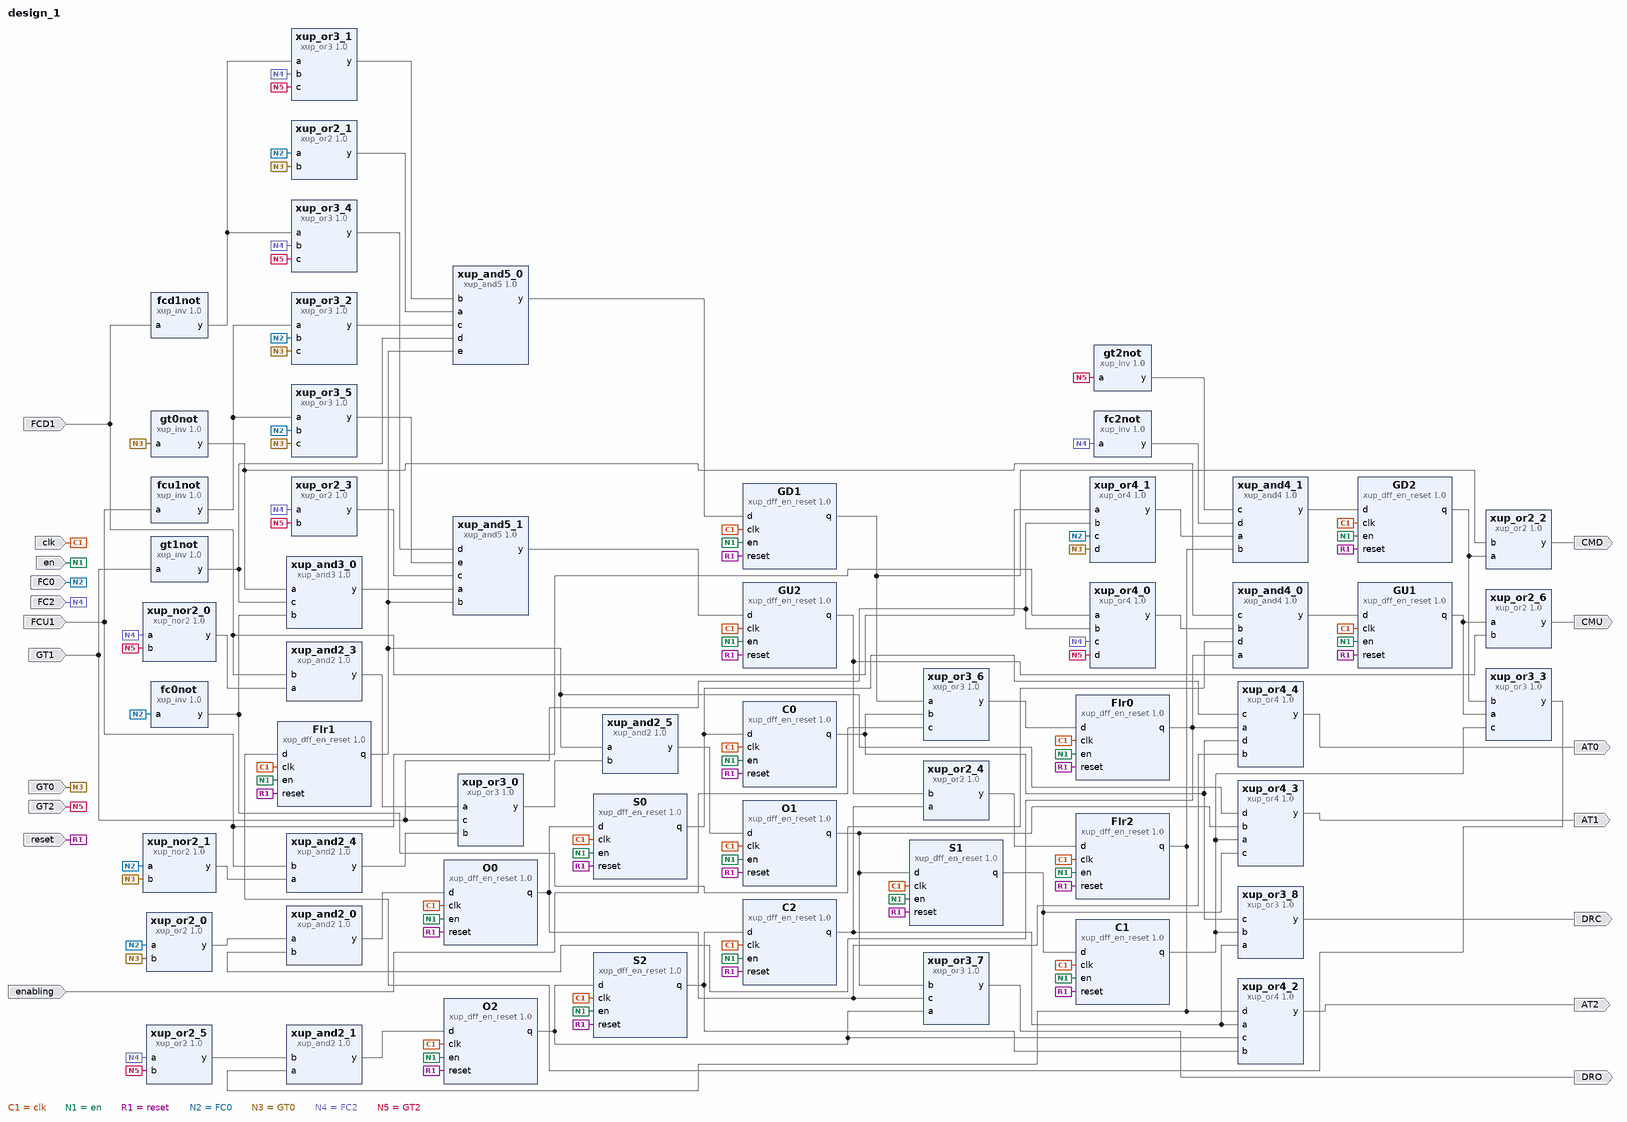
[diagram p0: block diagram of the top level]
# Vivado block design design_1, xc7k70tfbv676-1, Vivado 2020.1
create_bd_design design_1

create_bd_port -dir I FC0
create_bd_port -dir I FC2
create_bd_port -dir I FCU1
create_bd_port -dir I FCD1
create_bd_port -dir I GT0
create_bd_port -dir I GT1
create_bd_port -dir I GT2
create_bd_port -dir O DRC
create_bd_port -dir O DRO
create_bd_port -dir O AT0
create_bd_port -dir O AT1
create_bd_port -dir O AT2
create_bd_port -dir O CMU
create_bd_port -dir O CMD
create_bd_port -dir I en
create_bd_port -dir I reset
create_bd_port -dir I clk
create_bd_port -dir I enabling

create_bd_cell -type ip -vlnv xilinx.com:XUP:xup_dff_en_reset:1.0 Flr0
create_bd_cell -type ip -vlnv xilinx.com:XUP:xup_dff_en_reset:1.0 O0
create_bd_cell -type ip -vlnv xilinx.com:XUP:xup_dff_en_reset:1.0 S0
create_bd_cell -type ip -vlnv xilinx.com:XUP:xup_dff_en_reset:1.0 C0
create_bd_cell -type ip -vlnv xilinx.com:XUP:xup_or2:1.0 xup_or2_0
create_bd_cell -type ip -vlnv xilinx.com:XUP:xup_and2:1.0 xup_and2_0
create_bd_cell -type ip -vlnv xilinx.com:XUP:xup_dff_en_reset:1.0 GD1
create_bd_cell -type ip -vlnv xilinx.com:XUP:xup_dff_en_reset:1.0 GU1
create_bd_cell -type ip -vlnv xilinx.com:XUP:xup_and4:1.0 xup_and4_0
create_bd_cell -type ip -vlnv xilinx.com:XUP:xup_inv:1.0 fc2not
create_bd_cell -type ip -vlnv xilinx.com:XUP:xup_inv:1.0 gt2not
create_bd_cell -type ip -vlnv xilinx.com:XUP:xup_inv:1.0 gt1not
create_bd_cell -type ip -vlnv xilinx.com:XUP:xup_inv:1.0 fcu1not
create_bd_cell -type ip -vlnv xilinx.com:XUP:xup_inv:1.0 fcd1not
create_bd_cell -type ip -vlnv xilinx.com:XUP:xup_inv:1.0 fc0not
create_bd_cell -type ip -vlnv xilinx.com:XUP:xup_inv:1.0 gt0not
create_bd_cell -type ip -vlnv xilinx.com:XUP:xup_or4:1.0 xup_or4_0
create_bd_cell -type ip -vlnv xilinx.com:XUP:xup_dff_en_reset:1.0 Flr1
create_bd_cell -type ip -vlnv xilinx.com:XUP:xup_dff_en_reset:1.0 O1
create_bd_cell -type ip -vlnv xilinx.com:XUP:xup_dff_en_reset:1.0 S1
create_bd_cell -type ip -vlnv xilinx.com:XUP:xup_dff_en_reset:1.0 C1
create_bd_cell -type ip -vlnv xilinx.com:XUP:xup_or3:1.0 xup_or3_0
create_bd_cell -type ip -vlnv xilinx.com:XUP:xup_and2:1.0 xup_and2_3
create_bd_cell -type ip -vlnv xilinx.com:XUP:xup_and2:1.0 xup_and2_4
create_bd_cell -type ip -vlnv xilinx.com:XUP:xup_nor2:1.0 xup_nor2_0
create_bd_cell -type ip -vlnv xilinx.com:XUP:xup_nor2:1.0 xup_nor2_1
create_bd_cell -type ip -vlnv xilinx.com:XUP:xup_and5:1.0 xup_and5_0
create_bd_cell -type ip -vlnv xilinx.com:XUP:xup_or3:1.0 xup_or3_1
create_bd_cell -type ip -vlnv xilinx.com:XUP:xup_or3:1.0 xup_or3_2
create_bd_cell -type ip -vlnv xilinx.com:XUP:xup_or2:1.0 xup_or2_1
create_bd_cell -type ip -vlnv xilinx.com:XUP:xup_and2:1.0 xup_and2_5
create_bd_cell -type ip -vlnv xilinx.com:XUP:xup_dff_en_reset:1.0 GD2
create_bd_cell -type ip -vlnv xilinx.com:XUP:xup_or3:1.0 xup_or3_3
create_bd_cell -type ip -vlnv xilinx.com:XUP:xup_dff_en_reset:1.0 GU2
create_bd_cell -type ip -vlnv xilinx.com:XUP:xup_and3:1.0 xup_and3_0
create_bd_cell -type ip -vlnv xilinx.com:XUP:xup_and5:1.0 xup_and5_1
create_bd_cell -type ip -vlnv xilinx.com:XUP:xup_or3:1.0 xup_or3_4
create_bd_cell -type ip -vlnv xilinx.com:XUP:xup_or3:1.0 xup_or3_5
create_bd_cell -type ip -vlnv xilinx.com:XUP:xup_or2:1.0 xup_or2_3
create_bd_cell -type ip -vlnv xilinx.com:XUP:xup_dff_en_reset:1.0 Flr2
create_bd_cell -type ip -vlnv xilinx.com:XUP:xup_dff_en_reset:1.0 O2
create_bd_cell -type ip -vlnv xilinx.com:XUP:xup_dff_en_reset:1.0 S2
create_bd_cell -type ip -vlnv xilinx.com:XUP:xup_dff_en_reset:1.0 C2
create_bd_cell -type ip -vlnv xilinx.com:XUP:xup_or2:1.0 xup_or2_4
create_bd_cell -type ip -vlnv xilinx.com:XUP:xup_and2:1.0 xup_and2_1
create_bd_cell -type ip -vlnv xilinx.com:XUP:xup_or2:1.0 xup_or2_5
create_bd_cell -type ip -vlnv xilinx.com:XUP:xup_and4:1.0 xup_and4_1
create_bd_cell -type ip -vlnv xilinx.com:XUP:xup_or4:1.0 xup_or4_1
create_bd_cell -type ip -vlnv xilinx.com:XUP:xup_or3:1.0 xup_or3_6
create_bd_cell -type ip -vlnv xilinx.com:XUP:xup_or3:1.0 xup_or3_7
create_bd_cell -type ip -vlnv xilinx.com:XUP:xup_or3:1.0 xup_or3_8
create_bd_cell -type ip -vlnv xilinx.com:XUP:xup_or4:1.0 xup_or4_2
create_bd_cell -type ip -vlnv xilinx.com:XUP:xup_or4:1.0 xup_or4_3
create_bd_cell -type ip -vlnv xilinx.com:XUP:xup_or4:1.0 xup_or4_4
create_bd_cell -type ip -vlnv xilinx.com:XUP:xup_or2:1.0 xup_or2_2
create_bd_cell -type ip -vlnv xilinx.com:XUP:xup_or2:1.0 xup_or2_6

# ---- connections ----

connect_bd_net [get_bd_ports clk] \
  [get_bd_pins O0/clk] [get_bd_pins S0/clk] [get_bd_pins C0/clk] [get_bd_pins Flr0/clk] [get_bd_pins GD1/clk] \
  [get_bd_pins GU1/clk] [get_bd_pins Flr1/clk] [get_bd_pins O1/clk] [get_bd_pins S1/clk] [get_bd_pins C1/clk] \
  [get_bd_pins GU2/clk] [get_bd_pins GD2/clk] [get_bd_pins O2/clk] [get_bd_pins S2/clk] [get_bd_pins C2/clk] \
  [get_bd_pins Flr2/clk]
connect_bd_net [get_bd_ports en] \
  [get_bd_pins O0/en] [get_bd_pins Flr0/en] [get_bd_pins C0/en] [get_bd_pins S0/en] [get_bd_pins GD1/en] [get_bd_pins GU1/en] \
  [get_bd_pins Flr1/en] [get_bd_pins O1/en] [get_bd_pins C1/en] [get_bd_pins S1/en] [get_bd_pins GU2/en] [get_bd_pins GD2/en] \
  [get_bd_pins O2/en] [get_bd_pins S2/en] [get_bd_pins C2/en] [get_bd_pins Flr2/en]
connect_bd_net [get_bd_ports reset] \
  [get_bd_pins O0/reset] [get_bd_pins Flr0/reset] [get_bd_pins C0/reset] [get_bd_pins S0/reset] [get_bd_pins GD1/reset] \
  [get_bd_pins GU1/reset] [get_bd_pins Flr1/reset] [get_bd_pins O1/reset] [get_bd_pins S1/reset] [get_bd_pins C1/reset] \
  [get_bd_pins GU2/reset] [get_bd_pins GD2/reset] [get_bd_pins Flr2/reset] [get_bd_pins C2/reset] [get_bd_pins O2/reset] \
  [get_bd_pins S2/reset]
connect_bd_net -net DoorOpen0_q [get_bd_pins O0/q] [get_bd_pins S0/d] [get_bd_pins xup_or3_7/c] [get_bd_pins xup_or4_4/b]
connect_bd_net -net Wait0_q [get_bd_pins S0/q] [get_bd_pins C0/d] [get_bd_pins xup_or4_4/c]
connect_bd_net -net FC0_1 [get_bd_ports FC0] \
  [get_bd_pins xup_or2_0/a] [get_bd_pins fc0not/a] [get_bd_pins xup_nor2_1/a] [get_bd_pins xup_or2_1/a] \
  [get_bd_pins xup_or3_2/b] [get_bd_pins xup_or3_5/b] [get_bd_pins xup_or4_1/c]
connect_bd_net -net GT0_1 [get_bd_ports GT0] \
  [get_bd_pins xup_or2_0/b] [get_bd_pins gt0not/a] [get_bd_pins xup_nor2_1/b] [get_bd_pins xup_or2_1/b] \
  [get_bd_pins xup_or3_2/c] [get_bd_pins xup_or3_5/c] [get_bd_pins xup_or4_1/d]
connect_bd_net [get_bd_pins xup_or2_0/y] [get_bd_pins xup_and2_0/a]
connect_bd_net -net FLOOR0_q [get_bd_pins Flr0/q] [get_bd_pins xup_and2_0/b] [get_bd_pins xup_and4_0/a] [get_bd_pins xup_or4_4/a]
connect_bd_net [get_bd_pins xup_and2_0/y] [get_bd_pins O0/d]
connect_bd_net -net FC2_1 [get_bd_ports FC2] \
  [get_bd_pins fc2not/a] [get_bd_pins xup_or4_0/c] [get_bd_pins xup_nor2_0/a] [get_bd_pins xup_or3_1/b] \
  [get_bd_pins xup_or3_4/b] [get_bd_pins xup_or2_3/a] [get_bd_pins xup_or2_5/a]
connect_bd_net -net GT2_1 [get_bd_ports GT2] \
  [get_bd_pins gt2not/a] [get_bd_pins xup_or4_0/d] [get_bd_pins xup_nor2_0/b] [get_bd_pins xup_or3_1/c] \
  [get_bd_pins xup_or3_4/c] [get_bd_pins xup_or2_3/b] [get_bd_pins xup_or2_5/b]
connect_bd_net -net GT1_1 [get_bd_ports GT1] [get_bd_pins gt1not/a] [get_bd_pins xup_or4_0/b] [get_bd_pins xup_or3_0/c] [get_bd_pins xup_or4_1/b]
connect_bd_net -net FCU1_1 [get_bd_ports FCU1] [get_bd_pins fcu1not/a] [get_bd_pins xup_or4_0/a] [get_bd_pins xup_and2_4/b]
connect_bd_net -net FCD1_1 [get_bd_ports FCD1] [get_bd_pins fcd1not/a] [get_bd_pins xup_and2_3/b] [get_bd_pins xup_or4_1/a]
connect_bd_net [get_bd_pins xup_or4_0/y] [get_bd_pins xup_and4_0/b]
connect_bd_net -net notGT0_y [get_bd_pins gt0not/y] [get_bd_pins xup_and4_0/c] [get_bd_pins xup_and3_0/a]
connect_bd_net -net notFC0_y [get_bd_pins fc0not/y] [get_bd_pins xup_and4_0/d] [get_bd_pins xup_and3_0/b]
connect_bd_net [get_bd_pins xup_and4_0/y] [get_bd_pins GU1/d]
connect_bd_net -net DoorOpen1_q [get_bd_pins O1/q] [get_bd_pins S1/d] [get_bd_pins xup_or3_7/b] [get_bd_pins xup_or4_3/b]
connect_bd_net -net Wait1_q [get_bd_pins S1/q] [get_bd_pins C1/d] [get_bd_pins xup_or4_3/c]
connect_bd_net [get_bd_pins xup_and2_3/y] [get_bd_pins xup_or3_0/a]
connect_bd_net [get_bd_pins xup_and2_4/y] [get_bd_pins xup_or3_0/b]
connect_bd_net [get_bd_pins xup_nor2_0/y] [get_bd_pins xup_and2_3/a]
connect_bd_net [get_bd_pins xup_nor2_1/y] [get_bd_pins xup_and2_4/a]
connect_bd_net [get_bd_pins xup_and5_0/y] [get_bd_pins GD1/d]
connect_bd_net [get_bd_pins xup_or2_1/y] [get_bd_pins xup_and5_0/a]
connect_bd_net [get_bd_pins xup_or3_1/y] [get_bd_pins xup_and5_0/b]
connect_bd_net [get_bd_pins xup_or3_2/y] [get_bd_pins xup_and5_0/c]
connect_bd_net [get_bd_pins xup_or3_0/y] [get_bd_pins xup_and2_5/b]
connect_bd_net -net FLOOR1_q [get_bd_pins Flr1/q] \
  [get_bd_pins xup_and2_5/a] [get_bd_pins xup_and5_0/e] [get_bd_pins xup_and5_1/b] [get_bd_pins xup_or4_3/d]
connect_bd_net [get_bd_pins xup_and2_5/y] [get_bd_pins O1/d]
connect_bd_net -net notGT1_y [get_bd_pins gt1not/y] [get_bd_pins xup_and5_0/d] [get_bd_pins xup_and3_0/c]
connect_bd_net -net notFCD1_y [get_bd_pins fcd1not/y] [get_bd_pins xup_or3_1/a] [get_bd_pins xup_or3_4/a]
connect_bd_net -net notFCU1_y [get_bd_pins fcu1not/y] [get_bd_pins xup_or3_2/a] [get_bd_pins xup_or3_5/a]
connect_bd_net -net EU1_q [get_bd_pins GU1/q] [get_bd_pins xup_or3_3/a] [get_bd_pins xup_or2_6/a]
connect_bd_net -net ED2_q [get_bd_pins GD2/q] [get_bd_pins xup_or3_3/b] [get_bd_pins xup_or2_2/a]
connect_bd_net -net DoorClose1_q [get_bd_pins C1/q] [get_bd_pins xup_or3_3/c] [get_bd_pins xup_or3_8/b] [get_bd_pins xup_or4_3/a]
connect_bd_net [get_bd_pins xup_or3_3/y] [get_bd_pins Flr1/d]
connect_bd_net [get_bd_pins xup_and3_0/y] [get_bd_pins xup_and5_1/a]
connect_bd_net [get_bd_pins xup_and5_1/y] [get_bd_pins GU2/d]
connect_bd_net [get_bd_pins xup_or2_3/y] [get_bd_pins xup_and5_1/c]
connect_bd_net [get_bd_pins xup_or3_4/y] [get_bd_pins xup_and5_1/d]
connect_bd_net [get_bd_pins xup_or3_5/y] [get_bd_pins xup_and5_1/e]
connect_bd_net -net DoorOpen2_q [get_bd_pins O2/q] [get_bd_pins S2/d] [get_bd_pins xup_or3_7/a] [get_bd_pins xup_or4_2/c]
connect_bd_net -net Wait2_q [get_bd_pins S2/q] [get_bd_pins C2/d] [get_bd_pins xup_or4_2/b]
connect_bd_net [get_bd_pins xup_or2_4/y] [get_bd_pins Flr2/d]
connect_bd_net -net DoorClose2_q [get_bd_pins C2/q] [get_bd_pins xup_or2_4/a] [get_bd_pins xup_or3_8/a] [get_bd_pins xup_or4_2/a]
connect_bd_net -net EU2_q [get_bd_pins GU2/q] [get_bd_pins xup_or2_4/b] [get_bd_pins xup_or2_6/b]
connect_bd_net -net FLOOR2_q [get_bd_pins Flr2/q] [get_bd_pins xup_and2_1/a] [get_bd_pins xup_and4_1/b] [get_bd_pins xup_or4_2/d]
connect_bd_net [get_bd_pins xup_or2_5/y] [get_bd_pins xup_and2_1/b]
connect_bd_net [get_bd_pins xup_and2_1/y] [get_bd_pins O2/d]
connect_bd_net [get_bd_pins xup_and4_1/y] [get_bd_pins GD2/d]
connect_bd_net [get_bd_pins xup_or4_1/y] [get_bd_pins xup_and4_1/a]
connect_bd_net -net notGT2_y [get_bd_pins gt2not/y] [get_bd_pins xup_and4_1/c]
connect_bd_net -net notFC2_y [get_bd_pins fc2not/y] [get_bd_pins xup_and4_1/d]
connect_bd_net -net ED1_q [get_bd_pins GD1/q] [get_bd_pins xup_or3_6/a] [get_bd_pins xup_or2_2/b]
connect_bd_net -net DoorClose0_q [get_bd_pins C0/q] [get_bd_pins xup_or3_6/b] [get_bd_pins xup_or3_8/c] [get_bd_pins xup_or4_4/d]
connect_bd_net -net tempInput_1 [get_bd_ports enabling] [get_bd_pins xup_or3_6/c]
connect_bd_net [get_bd_pins xup_or3_6/y] [get_bd_pins Flr0/d]
connect_bd_net [get_bd_pins xup_or3_7/y] [get_bd_ports DRO]
connect_bd_net [get_bd_pins xup_or3_8/y] [get_bd_ports DRC]
connect_bd_net [get_bd_pins xup_or4_4/y] [get_bd_ports AT0]
connect_bd_net [get_bd_pins xup_or4_3/y] [get_bd_ports AT1]
connect_bd_net [get_bd_pins xup_or4_2/y] [get_bd_ports AT2]
connect_bd_net [get_bd_pins xup_or2_6/y] [get_bd_ports CMU]
connect_bd_net [get_bd_pins xup_or2_2/y] [get_bd_ports CMD]

validate_bd_design
save_bd_design
